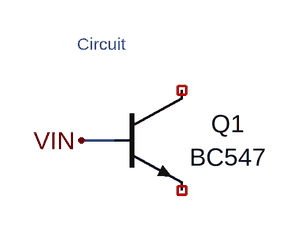
[diagram p0: schematic circuit.asc]
circuit.asc, the LTspice schematic file:
Version 4
SHEET 1 256 224
SYMBOL npn 448 336 R0
WINDOW 0 108 32 Center 2
WINDOW 3 108 64 Center 2
SYMATTR InstName Q1
SYMATTR Value BC547
WIRE 416 384 448 384
FLAG 416 384 VIN
TEXT 412 292 Left 1 ;Circuit

The netlist it stands for:
* circuit.asc
Q1 NC_01 VIN NC_02 0 BC547
.model NPN NPN
.model PNP PNP
.lib standard.bjt
* Circuit
.backanno
.end